# EAGLE design Power (EAGLE 4.09)
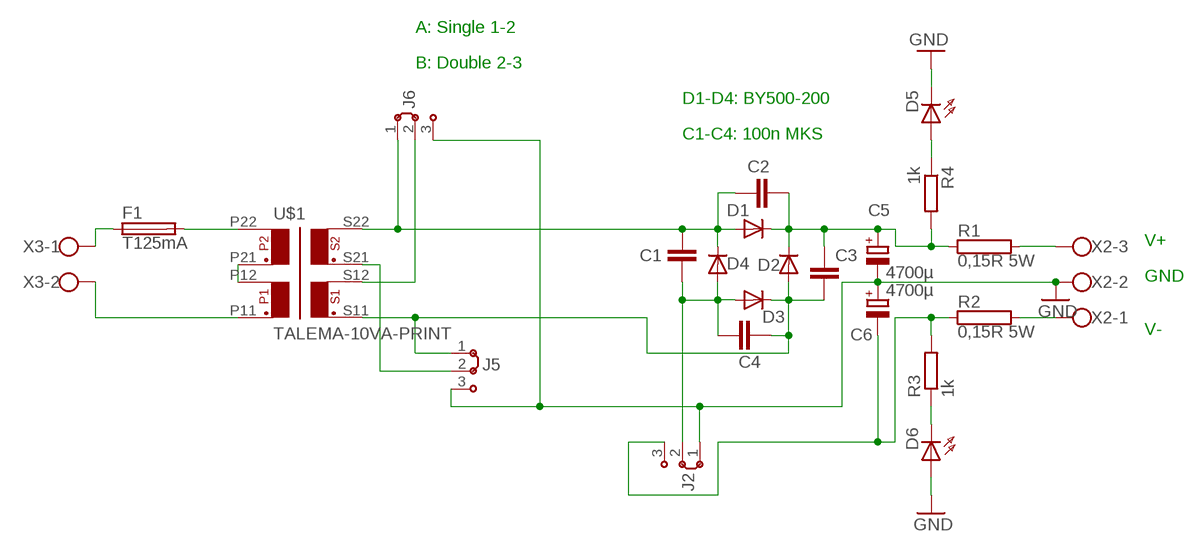
[diagram p0: schematic, sheet 1]

## Parts
C1  C-EU050-030X075  [C050-030X075]
C2  C-EU050-030X075  [C050-030X075]
C3  C-EU050-030X075  [C050-030X075]
C4  C-EU050-030X075  [C050-030X075]
C5  4700µ  CPOL-EUE7.5-18  [E7,5-18]
C6  4700µ  CPOL-EUE7.5-18  [E7,5-18]
D1  BY500  [DO201-15]
D2  BY500  [DO201-15]
D3  BY500  [DO201-15]
D4  BY500  [DO201-15]
D5  LED5MM  [LED5MM]
D6  LED5MM  [LED5MM]
F1  T125mA  SH22,5A  [SH22,5A]
J2  J2X2MM  [04C]
J5  J2X5MM  [05C]
J6  J2X5MM  [05C]
R1  0,15R 5W  RMPC71-5  [MPC71-5]
R2  0,15R 5W  RMPC71-5  [MPC71-5]
R3  1k  R-EU_0207/2V  [0207/2V]
R4  1k  R-EU_0207/2V  [0207/2V]
U$1  TALEMA-10VA-PRINT  [TALEMA-10VA]
X2  W237-103  [W237-103]
X3  W237-2N  [W237-2N]

## Nets
GND: C5.- C6.+ D5.K(C) D6.A J2.1 J5.3 J6.3 X2.2
N$1: U$1.P12 U$1.P21
N$2: U$1.P11 X3.2
N$3: F1.1 X3.1
N$4: C2.2 C3.1 C5.+ D1.C D2.C R1.1 R4.2
N$5: R2.2 X2.1
N$6: R1.2 X2.3
N$7: C1.1 C2.1 D1.A D4.C J6.1 U$1.S22
N$8: F1.2 U$1.P22
N$9: C6.- J2.3 R2.1 R3.2
N$10: C1.2 C4.1 D3.A D4.A J2.2
N$12: J6.2 U$1.S12
N$13: D6.K(C) R3.1
N$14: J5.2 U$1.S21
N$15: C3.2 C4.2 D2.A D3.C J5.1 U$1.S11
N$16: D5.A R4.1

## Notes on the sheet
- A: Single 1-2
- B: Double 2-3
- D1-D4: BY500-200
- C1-C4: 100n MKS
- V+
- GND
- V-

## Library data of the parts
C1-C4 = rcl:C-EU: CAPACITOR, European symbol
C5 C6 = rcl:CPOL-EU: POLARIZED CAPACITOR, European symbol
D1-D4 = diode:BY500: DIODE fast recovery diode, 5 A, 800 V
D5 D6 = led:LED: LED
F1 = fuse:SH22,5A: FUSE HOLDER grid 22,5mm, isolated cap OGN0031 8201, Schurter (Buerklin)
J2 J5 J6 = jumper:J2: Jumper switch 2 x 2.5 mm
R1 R2 = resistor-power:R: Power Resitor
R3 R4 = rcl:R-EU_: RESISTOR, European symbol
U$1 = ben:TALEMA-10VA-PRINT
X2 = con-wago-500:W237-103: WAGO SCREW CLAMP
X3 = con-wago-508:W237-2N: WAGO SREW CLAMP

## Board
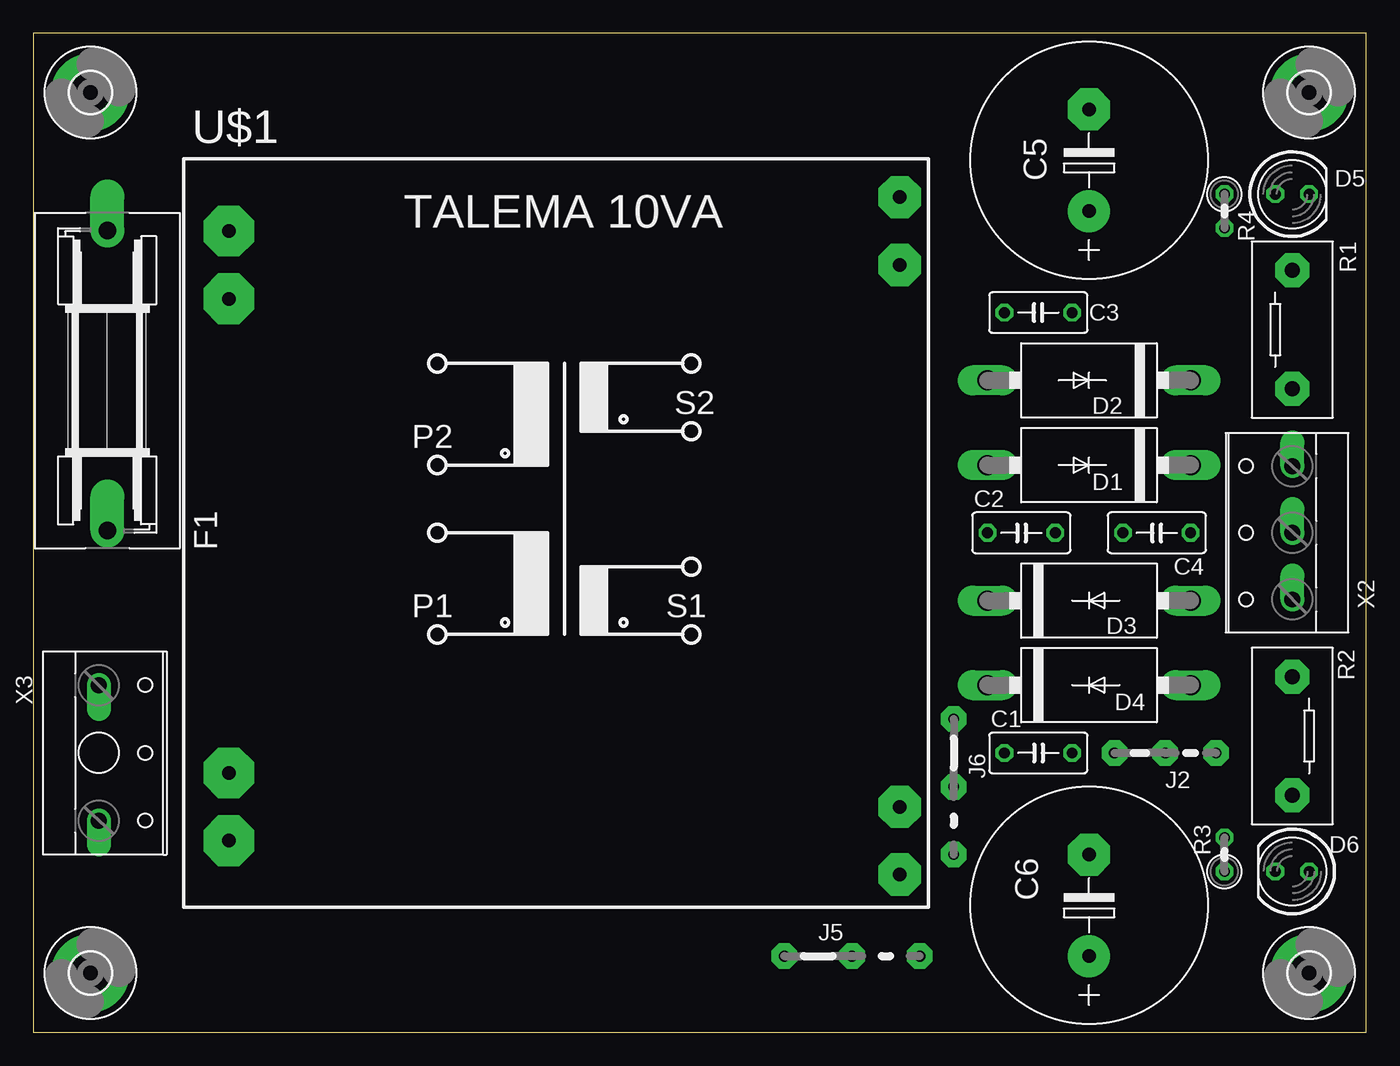
[diagram p1: board, top side]
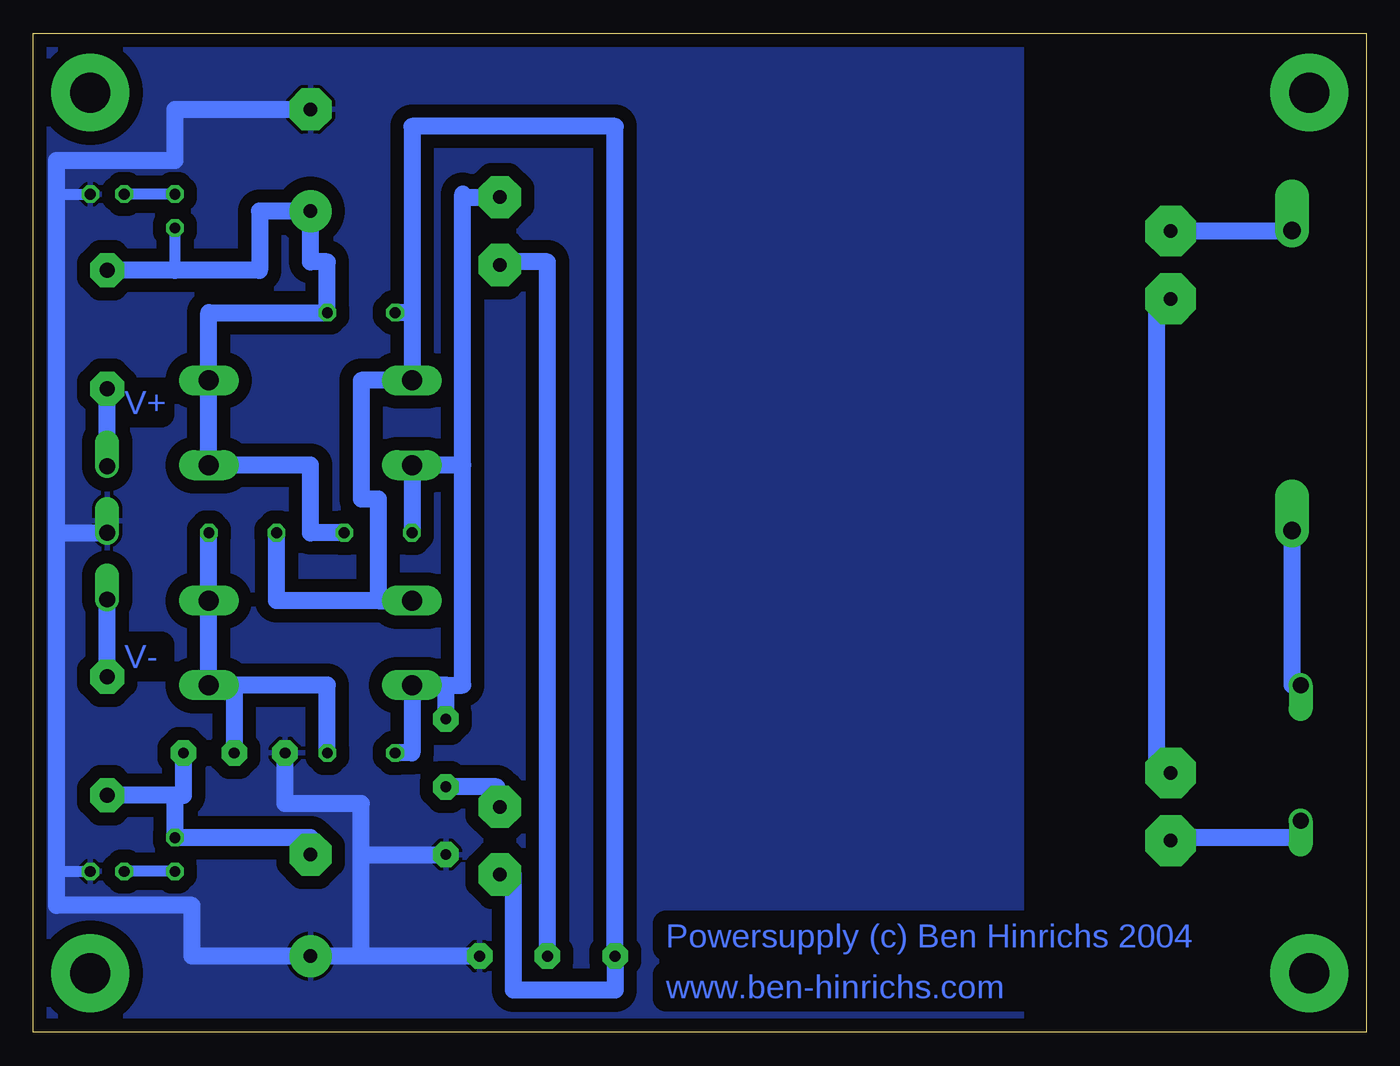
[diagram p2: board, bottom side, seen from below]

Size 100 x 74.92 mm. Coordinates in mm from the lower left corner, seen from the top.
Outline: 0,0 100,0 100,74.92 0,74.92 0,0
Copper layers used: Bottom

### Footprints (pad centres in the part's own frame; a part is rotated, then mirrored left to right if it is on the bottom)
C050-030X075 = drill 0.813 octagon: 1 -2.54,0; 2 2.54,0
E7,5-18 = drill 1.016 pad 3.15 round: + -3.81,0 | drill 1.016 pad 3.15 octagon: - 3.81,0
DO201-15 = drill 1.499 long: A 7.62,0; C -7.62,0
LED5MM = drill 0.813 octagon: A -1.27,0; K 1.27,0
3,0-PAD = drill 3 pad 5.842 round: B3,0 0,0
SH22,5A = drill 1.321 pad 2.54 offset: 1 -11.252,0; 2 11.252,0
04C = drill 0.813 pad 1.905 octagon: 1 -1.905,0; 2 1.905,0; 3 5.715,0
05C = drill 0.813 pad 1.905 octagon: 1 -2.54,0; 2 2.54,0; 3 7.62,0
MPC71-5 = drill 1.118 pad 2.54 octagon: 1 -4.445,0; 2 4.445,0
0207/2V = drill 0.813 octagon: 1 -1.27,0; 2 1.27,0
TALEMA-10VA = drill 1.016 pad 3.81 octagon: P11 -20.091,-23.089; P12 -20.091,-18.009; P21 -20.091,17.551; P22 -20.091,22.631 | drill 1.016 pad 3.175 octagon: S11 30.251,-25.629; S12 30.251,-20.549; S21 30.251,20.091; S22 30.251,25.171
W237-103 = drill 1.194 offset: 1 -5,-1.29; 2 0,-1.29; 3 5,-1.29
W237-2N = drill 1.194 offset: 1 -5.08,-0.635; 2 5.08,-0.635

### Placement (x,y rotation side)
C1  75.4,20.95 0 top
C2  74.13,37.46 0 top
C3  75.4,53.97 180 top
C4  84.29,37.46 180 top
C5  79.21,65.4 90 top
C6  79.21,9.52 90 top
D1  79.21,42.54 180 top
D2  79.21,48.89 180 top
D3  79.21,32.38 0 top
D4  79.21,26.03 0 top
D5  94.45,62.86 0 top
D6  94.45,12.06 180 top
E$1  [3,0-PAD]  4.28,70.48 0 top
E$2  [3,0-PAD]  4.28,4.44 0 top
E$3  [3,0-PAD]  95.72,4.44 0 top
E$4  [3,0-PAD]  95.72,70.48 0 top
F1  5.55,48.89 90 top
J2  83.02,20.95 0 top
J5  58.89,5.71 0 top
J6  69.05,20.95 270 top
R1  94.45,52.7 270 top
R2  94.45,22.22 90 top
R3  89.37,13.33 90 top
R4  89.37,61.59 270 top
U$1  34.76,37.46 0 top
X2  93.18,37.46 90 top
X3  5.55,20.95 270 top

### Tracks (layer width: path | path; a pad name or v marks a point on that pad's centre or on a via)
GND
  Bottom 0.813: 98.26,12.06 D6.A | 98.26,62.86 D5.K
  Bottom 1.27: C5.- 89.37,69.21 89.37,65.4 98.26,65.4 98.26,62.86 98.26,37.46 | 98.26,37.46 98.26,12.06 98.26,9.52 88.1,9.52 88.1,5.71 C6.+ 75.4,5.71 | 98.26,37.46 X2.2 | J5.3 75.4,5.71 | J2.1 81.11,17.14 75.4,17.14 75.4,13.33 | 75.4,5.71 75.4,13.33 | 75.4,13.33 J6.3
  pour Bottom (isolate 1): 25.87,74.29 99.53,74.29 99.53,0.63 25.87,0.63
N$1
  Bottom 1.27: U$1.P12 15.71,19.45 15.71,55.01 U$1.P21
N$2
  Bottom 1.27: U$1.P11 14.67,14.6 4.92,14.6 X3.2
N$3
  Bottom 1.27: X3.1 5.55,26.03 F1.1
N$4
  Bottom 0.813: 89.37,57.15 R4.2
  Bottom 1.27: C2.2 79.21,37.46 79.21,42.54 D1.C D2.C 86.83,53.97 C3.1 77.94,57.78 79.21,57.78 C5.+ 83.02,61.59 83.02,57.15 89.37,57.15 R1.1
N$5
  Bottom 1.27: X2.1 94.47,32.38 94.45,32.38 R2.2
N$6
  Bottom 1.27: X2.3 94.47,42.54 94.45,42.54 R1.2
N$7
  Bottom 1.27: C1.1 71.59,20.95 D4.C 69.05,26.03 | 69.05,26.03 67.78,26.03 67.78,42.54 | 67.78,42.54 D1.A C2.1 | 67.78,42.54 67.78,62.63 | 67.78,62.63 U$1.S22 | 67.78,62.63 67.78,62.86 | J6.1 69.05,26.03
N$8
  Bottom 1.27: 5.55,60.32 F1.2 5.55,60.09 U$1.P22
N$9
  Bottom 1.27: 89.37,17.77 88.73,17.77 J2.3 | 89.37,17.77 R2.1 | C6.- 79.21,14.6 R3.2 89.37,17.77
N$10
  Bottom 1.27: D3.A 86.83,32.46 | D3.A C4.1 | D4.A D3.A | C1.2 77.94,26.03 D4.A | J2.2 84.92,26.03 D4.A
N$12
  Bottom 1.27: U$1.S12 65.24,16.91 65.24,18.41 J6.2
N$13
  Bottom 0.813: R3.1 D6.K
N$14
  Bottom 1.27: 65.01,57.78 65.24,57.78 | 65.01,57.78 U$1.S21 | J5.2 61.43,57.78 65.01,57.78
N$15
  Bottom 1.27: 71.59,53.97 C3.2 | 71.59,53.97 D2.A 75.4,48.89 75.4,40 74.13,40 74.13,32.38 | C4.2 81.75,32.38 74.13,32.38 | 74.13,32.38 D3.C | 56.35,5.48 56.35,67.94 71.59,67.94 71.59,53.97 | U$1.S11 63.97,11.83 63.97,3.17 56.35,3.17 56.35,5.48 | 56.35,5.48 J5.1
N$16
  Bottom 0.813: R4.1 D5.A

### Text on the board
Bottom: V+ | V- | Powersupply (c) Ben Hinrichs 2004 | www.ben-hinrichs.com